# EAGLE design stomp (EAGLE 6.5.0)
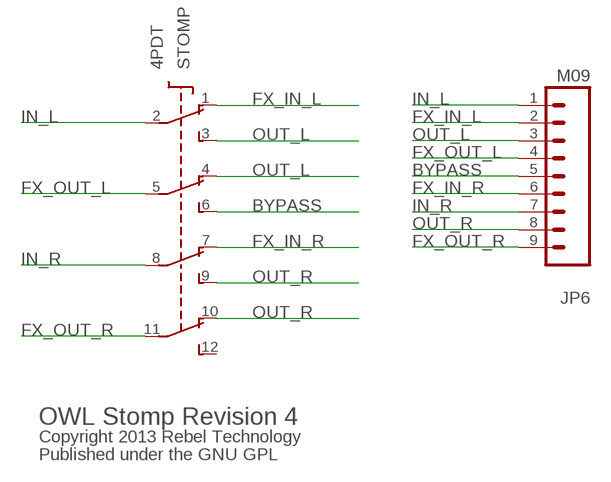
[diagram p0: schematic, sheet 1]

## Parts
JP6  M09  [1X09]
STOMP  4PDT  [4PDT]

## Nets
BYPASS: JP6.5 STOMP.6(S2)
FX_IN_L: JP6.2 STOMP.1(O1)
FX_IN_R: JP6.6 STOMP.7(O3)
FX_OUT_L: JP6.4 STOMP.5(P2)
FX_OUT_R: JP6.9 STOMP.11(P4)
IN_L: JP6.1 STOMP.2(P1)
IN_R: JP6.7 STOMP.8(P3)
OUT_L: JP6.3 STOMP.3(S1) STOMP.4(O2)
OUT_R: JP6.8 STOMP.9(S3) STOMP.10(O4)
Unconnected: STOMP.12(S4)

## Notes on the sheet
- OWL Stomp Revision 4
- Copyright 2013 Rebel Technology
- Published under the GNU GPL

## Library data of the parts
JP6 = SparkFun:M09: Header 9 Standard 9-pin 0.1" header. Use with straight break away headers (SKU : PRT-00116), right angle break away headers (PRT-00553), swiss pins (PRT-00743), machine pins (PRT-00117), and female headers (PRT-00115).
STOMP = Rebel:4PDT

## Board
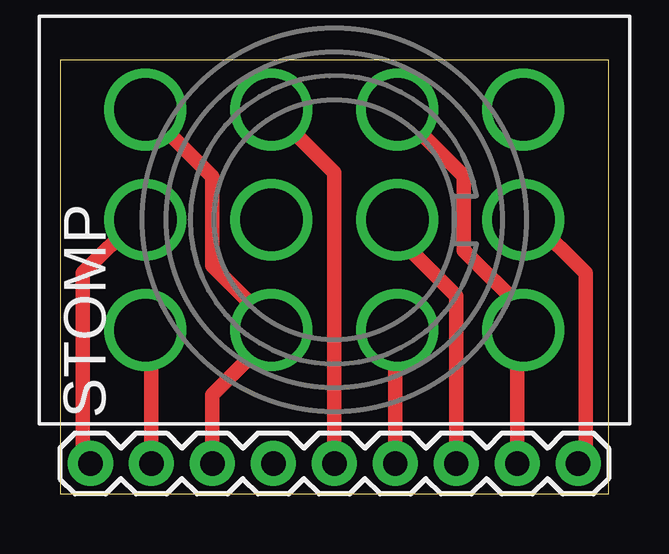
[diagram p1: board, top side]
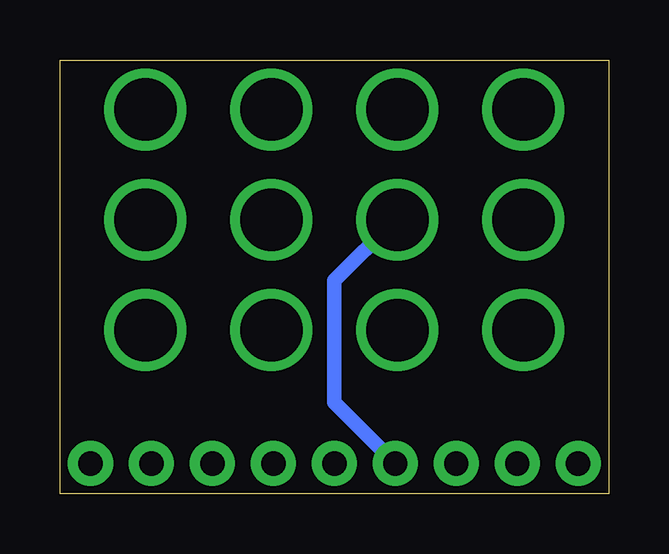
[diagram p2: board, bottom side, seen from below]

Size 22.86 x 18.1 mm. Coordinates in mm from the lower left corner, seen from the top.
Outline: 0,0 22.86,0 22.86,18.1 0,18.1 0,0
Copper layers (1*2+15*16): Top 0.035mm / dielectric 1.5mm / Route2 0.035mm / dielectric 0.15mm / Route15 0.035mm / dielectric 0.2mm / Bottom 0.035mm
Design rules "Rebel": minimum track width 6mil, minimum drill 12mil, track to track 6mil, track to pad 6mil, pad to pad 6mil, via to via 6mil, smd to smd 0mil, copper to edge 10mil, drill to drill 10mil, minimum pad ring 10mil, minimum via ring 6mil, stop-mask expansion 2mil, vias tented up to drill 100mil, thermal gap 10mil

### Footprints (pad centres in the part's own frame; a part is rotated, then mirrored left to right if it is on the bottom)
1X09 = drill 1.016 pad 1.88: 1 0,0; 2 2.54,0; 3 5.08,0; 4 7.62,0; 5 10.16,0; 6 12.7,0; 7 15.24,0; 8 17.78,0; 9 20.32,0
4PDT = drill 2.6: 1 -4.6,7.875; 2 0,7.875; 3 4.6,7.875; 4 -4.6,2.625; 5 0,2.625; 6 4.6,2.625; 7 -4.6,-2.625; 8 0,-2.625; 9 4.6,-2.625; 10 -4.6,-7.875; 11 0,-7.875; 12 4.6,-7.875

### Placement (x,y rotation side)
JP6  1.27,1.27 0 top
STOMP  11.43,11.43 90 top

### Tracks (layer width: path | path; a pad name or v marks a point on that pad's centre or on a via)
BYPASS
  Top 0.61: STOMP.6 11.43,13.41 JP6.5
FX_IN_L
  Top 0.61: JP6.2 3.81,6.58 STOMP.1
FX_IN_R
  Top 0.61: JP6.6 13.97,6.75 STOMP.7
FX_OUT_L
  Bottom 0.61: STOMP.5 8.89,11.43 11.43,8.89 11.43,3.81 JP6.4
FX_OUT_R
  Top 0.61: STOMP.11 19.69,11.43 21.91,9.21 21.91,1.59 JP6.9
IN_L
  Top 0.61: STOMP.2 3.17,11.43 0.95,9.21 0.95,1.59 JP6.1
IN_R
  Top 0.61: JP6.7 16.51,8.26 13.97,10.8 13.97,11.34 STOMP.8
OUT_L
  Top 0.61: JP6.3 6.35,4.13 8.89,6.67 8.89,6.75 STOMP.4 8.89,6.91 8.89,6.98 6.35,9.52 6.35,13.23 STOMP.3
OUT_R
  Top 0.61: JP6.8 19.05,6.58 STOMP.10 19.3,7.68 16.83,10.16 16.83,13.26 STOMP.9